# EAGLE design E-P-206-R1.0 Fuel Cell Control (EAGLE 6.6.0)

## Sheet 1 of 3: Connectors
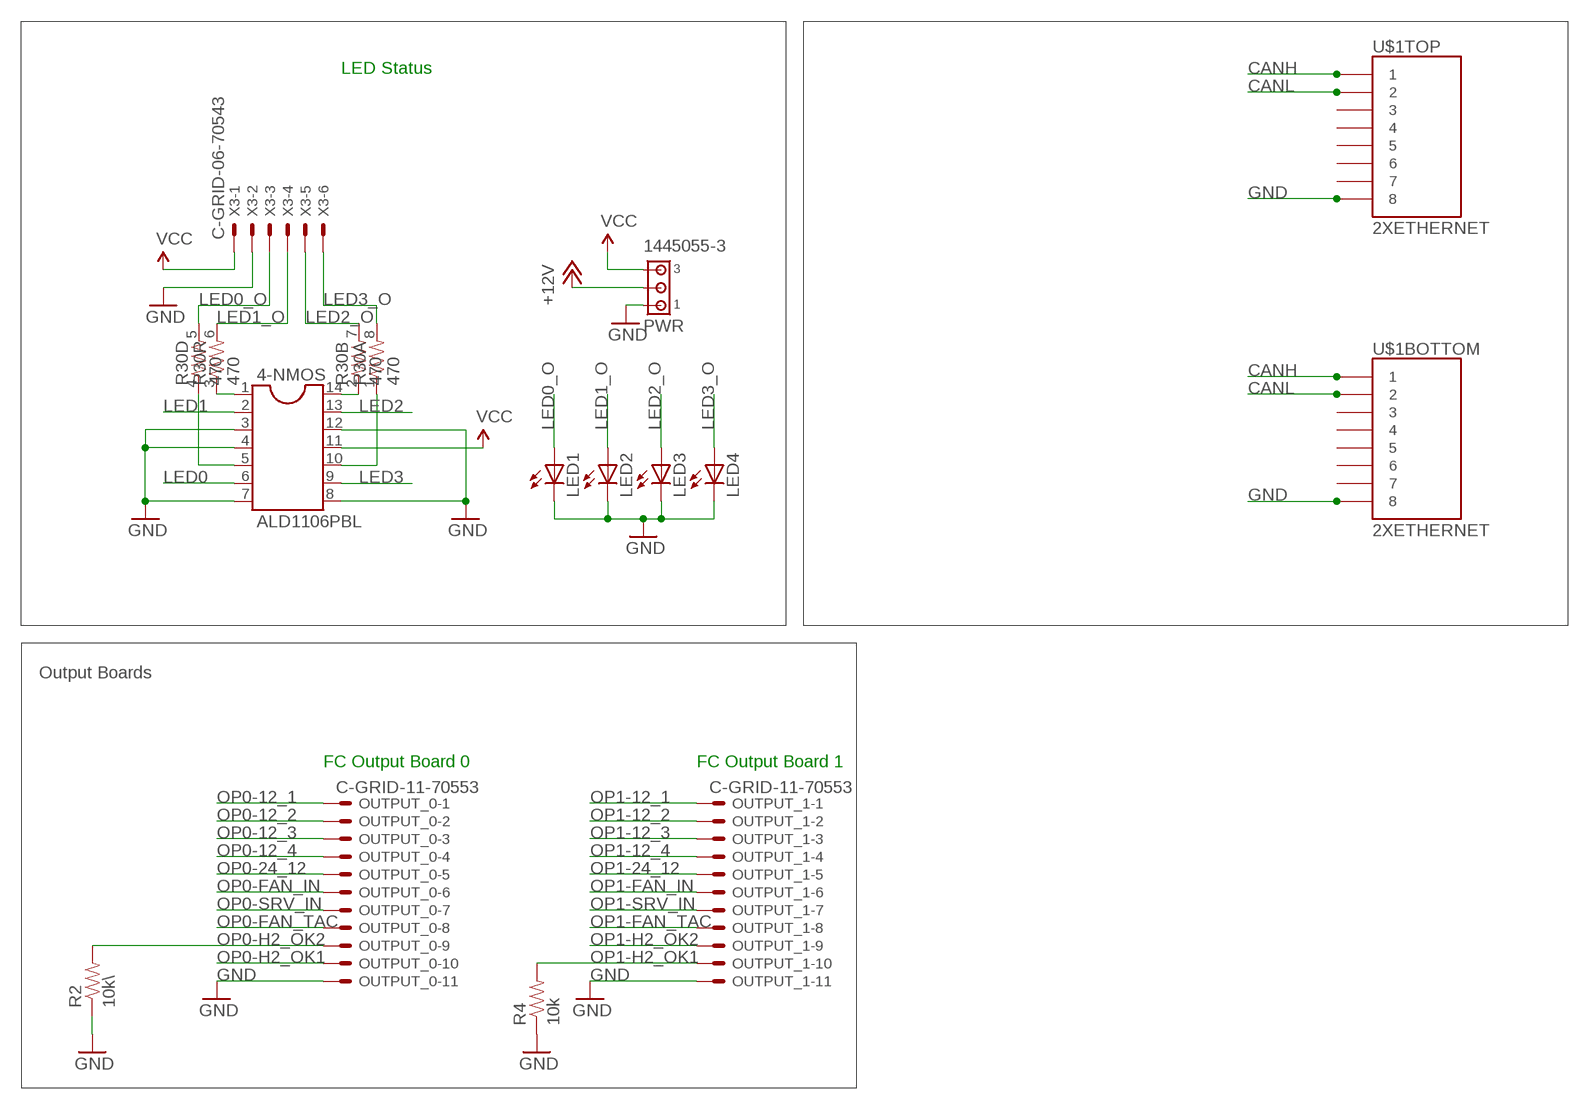
[diagram p0: schematic, sheet 1]

### Parts
4-NMOS  ALD1106PBL  DIL14SOIC  [SOIC-14]
LED1  LEDCHIPLED_1206  [CHIPLED_1206]
LED2  LEDCHIPLED_1206  [CHIPLED_1206]
LED3  LEDCHIPLED_1206  [CHIPLED_1206]
LED4  LEDCHIPLED_1206  [CHIPLED_1206]
OUTPUT_0  C-GRID-11-70553  [70553-11]
OUTPUT_1  C-GRID-11-70553  [70553-11]
PWR  1445055-3  [1445055-3]
R2  10k\  RESISTOR1206  [1206]
R4  10k  RESISTOR1206  [1206]
R30  470  RESISTOR-ARRAY0603-ARV  [0603-ARV]
U$1  2XETHERNET  [2XETHERNET]
X3  C-GRID-06-70543  [70543-06]

### Nets
+12V: PWR.2 ; also sheet 2
CANH: U$1.B_1 U$1.T_1 ; also sheet 3
CANL: U$1.B_2 U$1.T_2 ; also sheet 3
GND: 4-NMOS.3 4-NMOS.4 4-NMOS.7 4-NMOS.8 4-NMOS.12 LED1.C LED2.C LED3.C LED4.C OUTPUT_0.11 OUTPUT_1.11 PWR.1 R2.1 R4.1 U$1.B_8 U$1.T_8 X3.2 ; also sheet 2,3
LED0: 4-NMOS.6 ; also sheet 3
LED0_O: LED1.A R30.5 X3.3
LED1: 4-NMOS.2 ; also sheet 3
LED1_O: LED2.A R30.6 X3.4
LED2: 4-NMOS.13 ; also sheet 3
LED2_O: LED3.A R30.7 X3.5
LED3: 4-NMOS.9 ; also sheet 3
LED3_O: LED4.A R30.8 X3.6
N$2: 4-NMOS.5 R30.4
N$4: 4-NMOS.1 R30.3
N$7: 4-NMOS.14 R30.2
N$8: 4-NMOS.10 R30.1
OP0-12_1: OUTPUT_0.1 ; also sheet 3
OP0-12_2: OUTPUT_0.2 ; also sheet 3
OP0-12_3: OUTPUT_0.3 ; also sheet 3
OP0-12_4: OUTPUT_0.4 ; also sheet 3
OP0-24_12: OUTPUT_0.5 ; also sheet 3
OP0-FAN_IN: OUTPUT_0.6 ; also sheet 3
OP0-FAN_TAC: OUTPUT_0.8 ; also sheet 3
OP0-H2_OK1: OUTPUT_0.10 ; also sheet 3
OP0-H2_OK2: OUTPUT_0.9 R2.2 ; also sheet 3
OP0-SRV_IN: OUTPUT_0.7 ; also sheet 3
OP1-12_1: OUTPUT_1.1 ; also sheet 3
OP1-12_2: OUTPUT_1.2 ; also sheet 3
OP1-12_3: OUTPUT_1.3 ; also sheet 3
OP1-12_4: OUTPUT_1.4 ; also sheet 3
OP1-24_12: OUTPUT_1.5 ; also sheet 3
OP1-FAN_IN: OUTPUT_1.6 ; also sheet 3
OP1-FAN_TAC: OUTPUT_1.8 ; also sheet 3
OP1-H2_OK1: OUTPUT_1.10 R4.2 ; also sheet 3
OP1-H2_OK2: OUTPUT_1.9 ; also sheet 3
OP1-SRV_IN: OUTPUT_1.7 ; also sheet 3
VCC: 4-NMOS.11 PWR.3 X3.1 ; also sheet 2,3
Unconnected: U$1.B_3 U$1.B_4 U$1.B_5 U$1.B_6 U$1.B_7 U$1.B_9(BTM_LED_0:A) U$1.B_10(BTM_LED_0:C) U$1.B_11(BTM_LED_1:A) U$1.B_12(BTM_LED_1:C) U$1.T_3 U$1.T_4 U$1.T_5 U$1.T_6 U$1.T_7 U$1.T_9(TOP_LED_0:A) U$1.T_10(TOP_LED_0:C) U$1.T_11(TOP_LED_1:A) U$1.T_12(TOP_LED_1:C)

### Notes on the sheet
- LED Status
- Output Boards
- FC Output Board 0 | FC Output Board 1

## Sheet 2 of 3: Sensors
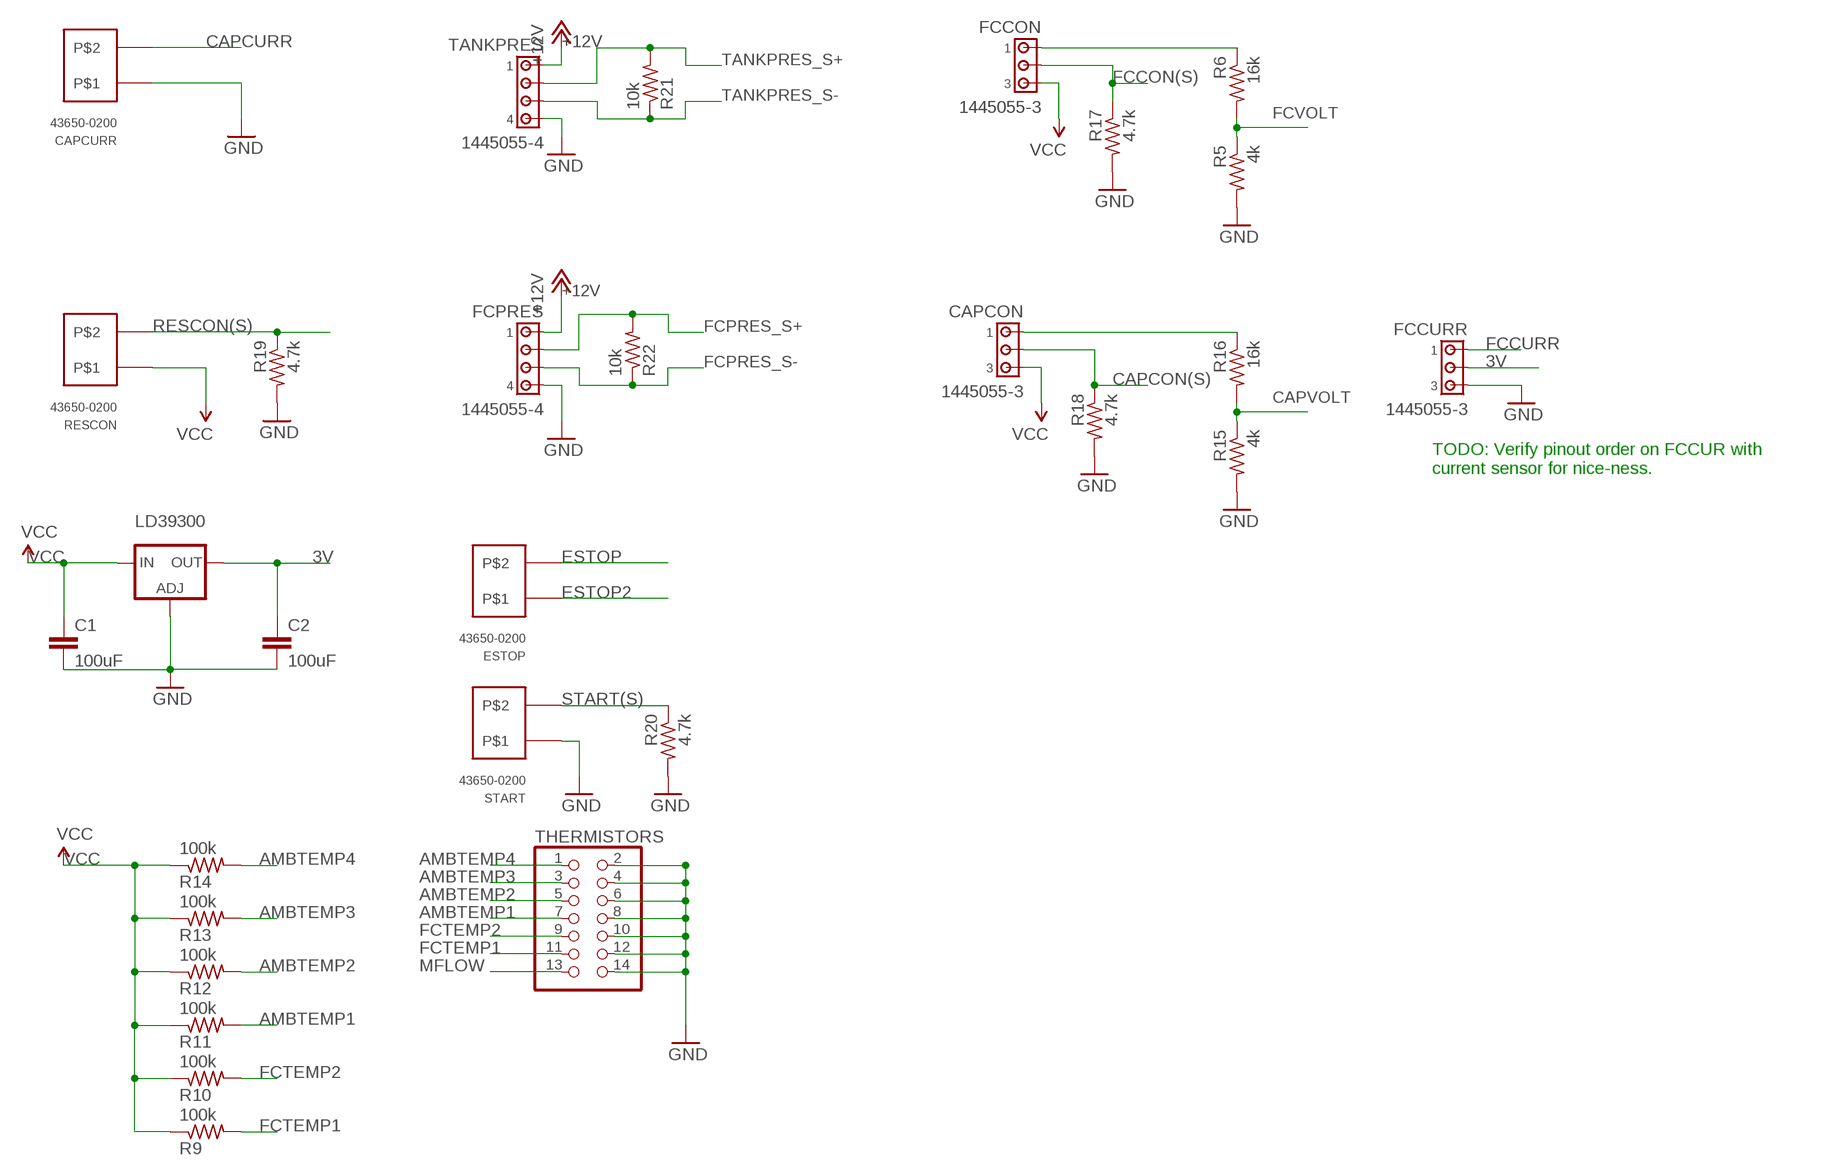
[diagram p1: schematic, sheet 2]

### Parts
C1  100uF  CAP1206  [1206]
C2  100uF  CAP1206  [1206]
CAPCON  1445055-3  [1445055-3]
CAPCURR  43650-0200  [43650-0200]
ESTOP  43650-0200  [43650-0200]
FCCON  1445055-3  [1445055-3]
FCCURR  1445055-3  [1445055-3]
FCPRES  1445055-4  [1445055-4]
LD39300  LD117ADT50TR  [DPACK]
R5  4k  R-US_M0805  [M0805]
R6  16k  R-US_M0805  [M0805]
R9  100k  R-US_M0805  [M0805]
R10  100k  R-US_M0805  [M0805]
R11  100k  R-US_M0805  [M0805]
R12  100k  R-US_M0805  [M0805]
R13  100k  R-US_M0805  [M0805]
R14  100k  R-US_M0805  [M0805]
R15  4k  R-US_M0805  [M0805]
R16  16k  R-US_M0805  [M0805]
R17  4.7k  R-US_M0805  [M0805]
R18  4.7k  R-US_M0805  [M0805]
R19  4.7k  R-US_M0805  [M0805]
R20  4.7k  R-US_M0805  [M0805]
R21  10k  R-US_M0805  [M0805]
R22  10k  R-US_M0805  [M0805]
RESCON  43650-0200  [43650-0200]
START  43650-0200  [43650-0200]
TANKPRES  1445055-4  [1445055-4]
THERMISTORS  PINHD-2X7  [2X07]

### Nets
3V: C2.1 FCCURR.2 LD39300.4(OUT)
+12V: FCPRES.1 TANKPRES.1 ; also sheet 1
AMBTEMP1: R11.2 THERMISTORS.7 ; also sheet 3
AMBTEMP2: R12.2 THERMISTORS.5 ; also sheet 3
AMBTEMP3: R13.2 THERMISTORS.3 ; also sheet 3
AMBTEMP4: R14.2 THERMISTORS.1 ; also sheet 3
CAPCON(S): CAPCON.2 R18.1
CAPCURR: CAPCURR.P$1 ; also sheet 3
CAPVOLT: R15.1 R16.2 ; also sheet 3
ESTOP: ESTOP.P$1 ; also sheet 3
ESTOP2: ESTOP.P$2 ; also sheet 3
FCCON(S): FCCON.2 R17.1
FCCURR: FCCURR.1 ; also sheet 3
FCPRES_S+: FCPRES.2 R22.2 ; also sheet 3
FCPRES_S-: FCPRES.3 R22.1 ; also sheet 3
FCTEMP1: R9.2 THERMISTORS.11 ; also sheet 3
FCTEMP2: R10.2 THERMISTORS.9 ; also sheet 3
FCVOLT: R5.1 R6.2 ; also sheet 3
FCVOLT+: FCCON.1 R6.1
FCVOLT+1: CAPCON.1 R16.1
GND: C1.2 C2.2 CAPCURR.P$2 FCCURR.3 FCPRES.4 LD39300.1(ADJ) R5.2 R15.2 R17.2 R18.2 R19.2 R20.2 START.P$2 TANKPRES.4 THERMISTORS.2 THERMISTORS.4 THERMISTORS.6 THERMISTORS.8 THERMISTORS.10 THERMISTORS.12 THERMISTORS.14 ; also sheet 1,3
MFLOW: THERMISTORS.13 ; also sheet 3
RESCON(S): R19.1 RESCON.P$1
START(S): R20.1 START.P$1
TANKPRES_S+: R21.2 TANKPRES.2 ; also sheet 3
TANKPRES_S-: R21.1 TANKPRES.3 ; also sheet 3
VCC: C1.1 CAPCON.3 FCCON.3 LD39300.3(IN) R9.1 R10.1 R11.1 R12.1 R13.1 R14.1 RESCON.P$2 ; also sheet 1,3

### Notes on the sheet
- TODO: Verify pinout order on FCCUR with 
  current sensor for nice-ness.

## Sheet 3 of 3: MCU
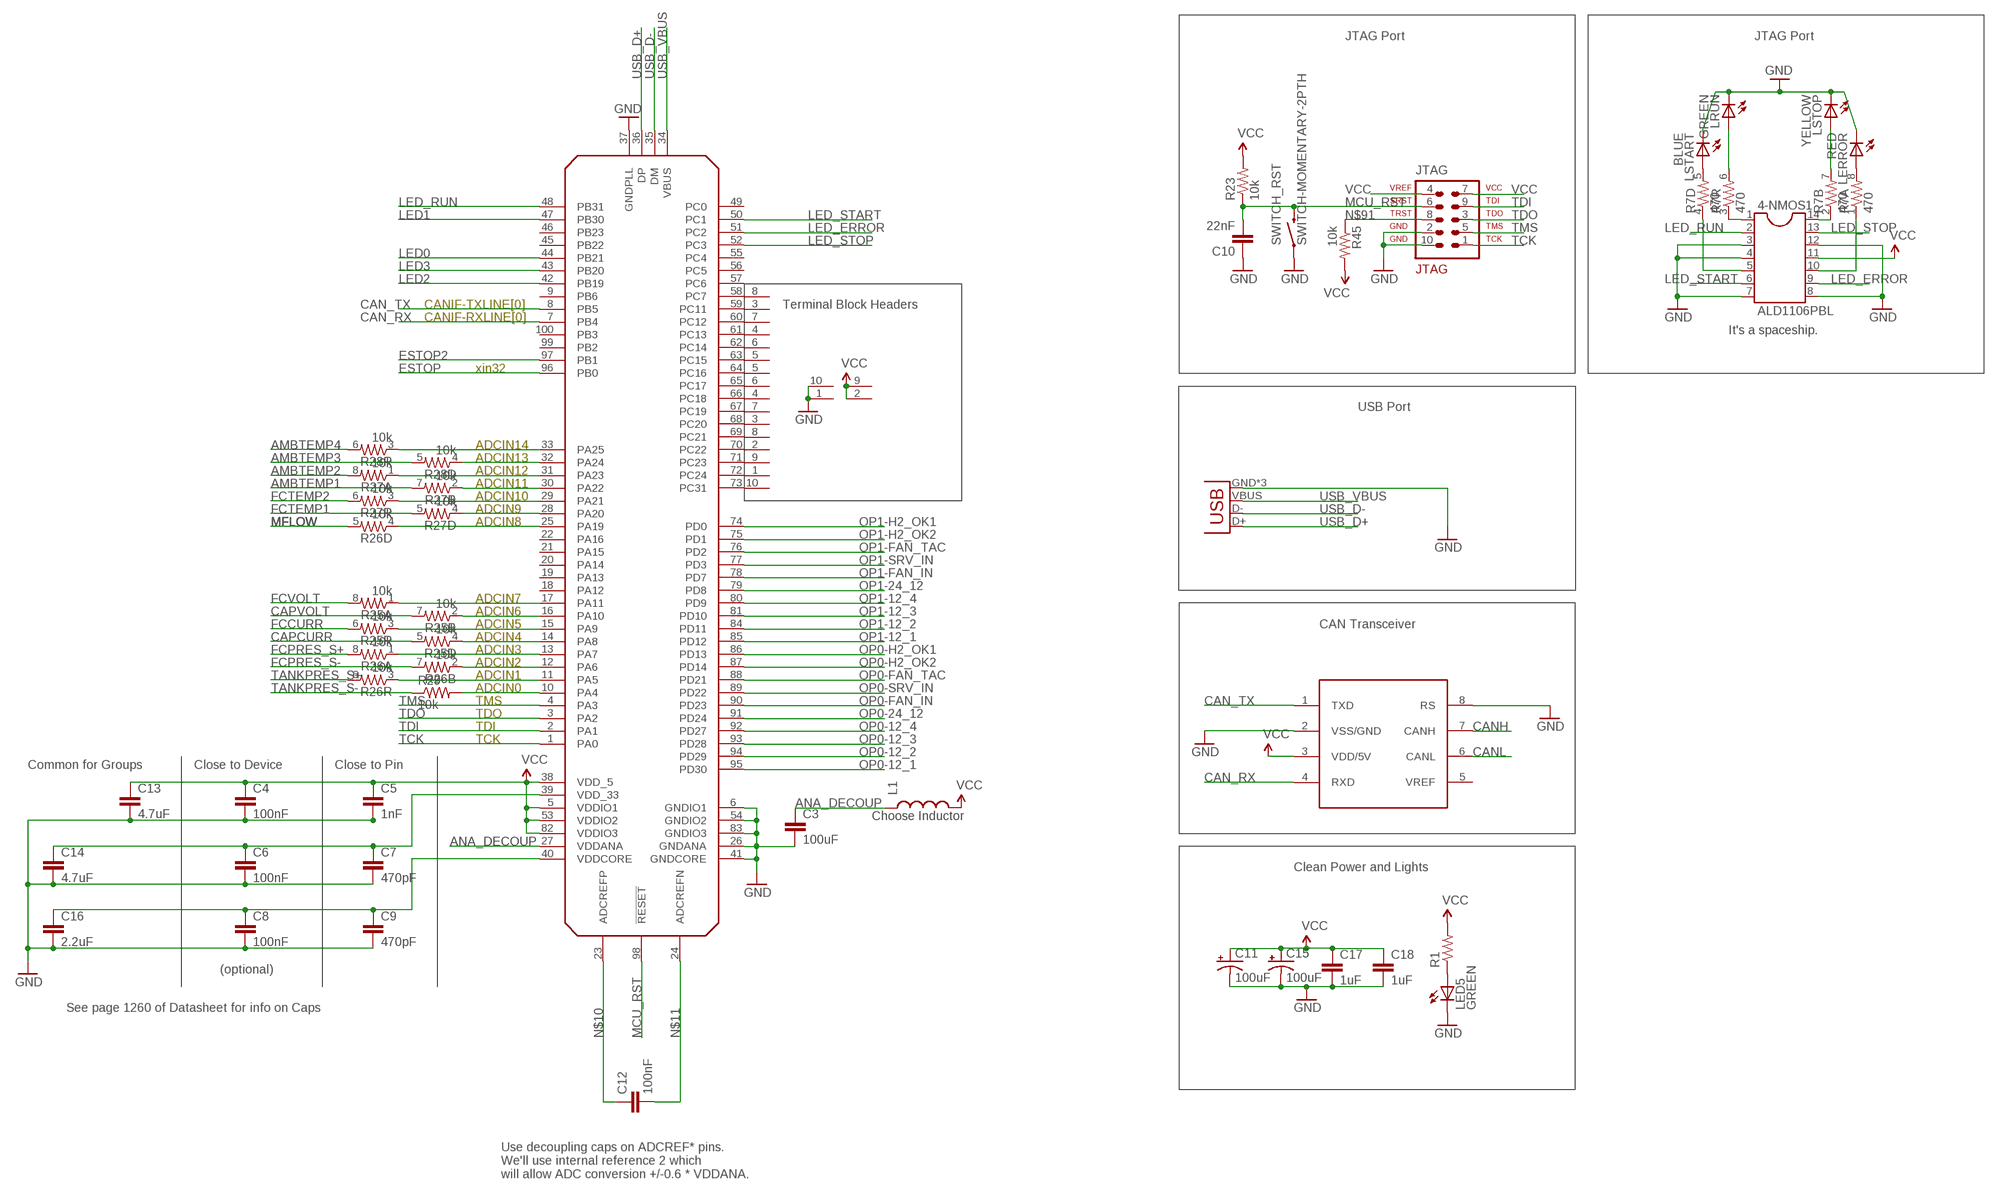
[diagram p2: schematic, sheet 3]

### Parts
4-NMOS1  ALD1106PBL  DIL14SOIC  [SOIC-14]
C3  100uF  CAP0805  [0805]
C4  100nF  CAP0805  [0805]
C5  1nF  CAP0805  [0805]
C6  100nF  CAP0805  [0805]
C7  470pF  CAP0805  [0805]
C8  100nF  CAP0805  [0805]
C9  470pF  CAP0805  [0805]
C10  22nF  CAP0805  [0805]
C11  100uF  CAP_POLC  [PANASONIC_C]
C12  100nF  CAP0805  [0805]
C13  4.7uF  CAP0805  [0805]
C14  4.7uF  CAP0805  [0805]
C15  100uF  CAP_POLC  [PANASONIC_C]
C16  2.2uF  CAP0805  [0805]
C17  1uF  CAP0805  [0805]
C18  1uF  CAP0805  [0805]
JP2  USB-MICROB  [USB-MICROB]
JTAG  AVR-JTAG-10  [AVR-JTAG-10]
L1  INDUCTOR0805  [0805]
LED5  GREEN  LED1206  [LED-1206]
LERROR  RED  LEDCHIPLED_1206  [CHIPLED_1206]
LRUN  GREEN  LEDCHIPLED_1206  [CHIPLED_1206]
LSTART  BLUE  LEDCHIPLED_1206  [CHIPLED_1206]
LSTOP  YELLOW  LEDCHIPLED_1206  [CHIPLED_1206]
MCU  AT32UC3C1512  [TQFP100]
R1  RESISTOR0805-RES  [0805]
R7  470  RESISTOR-ARRAY0603-ARV  [0603-ARV]
R23  10k  RESISTOR0805-RES  [0805]
R25  10k  RESISTOR-ARRAY0603-ARV  [0603-ARV]
R26  10k  RESISTOR-ARRAY0603-ARV  [0603-ARV]
R27  10k  RESISTOR-ARRAY0603-ARV  [0603-ARV]
R28  10k  RESISTOR-ARRAY0603-ARV  [0603-ARV]
R29  10k  RESISTOR0805-RES  [0805]
R45  10k  RESISTOR0805-RES  [0805]
SWITCH_RST  SWITCH-MOMENTARY-2PTH  [TACTILE-PTH]
U$2  10X1PCBBLOCK  [10X1PCBBLOCK]
U$3  10X1PCBBLOCK  [10X1PCBBLOCK]
U$4  MCP2551  [DIP8]

### Nets
AMBTEMP1: R27.7 ; also sheet 2
AMBTEMP2: R27.8 ; also sheet 2
AMBTEMP3: R28.5 ; also sheet 2
AMBTEMP4: R28.6 ; also sheet 2
ANA_DECOUP: C3.1 L1.1 MCU.27(VDDANA)
CAN_RX: MCU.7(PB4) U$4.4(RXD)
CAN_TX: MCU.8(PB5) U$4.1(TXD)
CANH: U$4.7(CANH) ; also sheet 1
CANL: U$4.6(CANL) ; also sheet 1
CAPCURR: R25.5 ; also sheet 2
CAPVOLT: R25.7 ; also sheet 2
ESTOP: MCU.96(PB0) ; also sheet 2
ESTOP2: MCU.97(PB1) ; also sheet 2
FCCURR: R25.6 ; also sheet 2
FCPRES_S+: R26.8 ; also sheet 2
FCPRES_S-: R26.7 ; also sheet 2
FCTEMP1: R27.5 ; also sheet 2
FCTEMP2: R27.6 ; also sheet 2
FCVOLT: R25.8 ; also sheet 2
GND: 4-NMOS1.3 4-NMOS1.4 4-NMOS1.7 4-NMOS1.8 4-NMOS1.12 C3.2 C4.2 C5.2 C6.2 C7.2 C8.2 C9.2 C10.1 C11.- C13.2 C14.2 C15.- C16.2 C17.2 C18.2 JP2.GND JP2.MT1(GND) JP2.MT2(GND) JTAG.2 JTAG.10 LED5.C LERROR.C LRUN.C LSTART.C LSTOP.C MCU.6(GNDIO1) MCU.26(GNDANA) MCU.37(GNDPLL) MCU.41(GNDCORE) MCU.54(GNDIO2) MCU.83(GNDIO3) SWITCH_RST.1 U$2.10 U$3.1 U$4.2(VSS/GND) U$4.8(RS) ; also sheet 1,2
LED0: MCU.44(PB21) ; also sheet 1
LED1: MCU.47(PB30) ; also sheet 1
LED2: MCU.42(PB19) ; also sheet 1
LED3: MCU.43(PB20) ; also sheet 1
LED_ERROR: 4-NMOS1.9 MCU.51(PC2)
LED_RUN: 4-NMOS1.2 MCU.48(PB31)
LED_START: 4-NMOS1.6 MCU.50(PC1)
LED_STOP: 4-NMOS1.13 MCU.52(PC3)
MCU_RST: C10.2 JTAG.6 MCU.98(!RESET) R23.1 SWITCH_RST.3
MFLOW: R26.5 ; also sheet 2
N$1: MCU.10(PA4) R29.2
N$3: MCU.12(PA6) R26.2
N$5: MCU.13(PA7) R26.1
N$6: C6.1 C7.1 C14.1 MCU.39(VDD_33)
N$9: C8.1 C9.1 C16.1 MCU.40(VDDCORE)
N$10: C12.1 MCU.23(ADCREFP)
N$11: C12.2 MCU.24(ADCREFN)
N$12: MCU.72(PC24) U$2.1
N$13: MCU.11(PA5) R26.3
N$14: MCU.70(PC22) U$2.2
N$15: MCU.25(PA19) R26.4
N$16: MCU.68(PC20) U$2.3
N$17: MCU.28(PA20) R27.4
N$18: MCU.30(PA22) R27.2
N$19: MCU.32(PA24) R28.4
N$20: MCU.33(PA25) R28.3
N$21: MCU.14(PA8) R25.4
N$22: MCU.66(PC18) U$2.4
N$23: MCU.64(PC16) U$2.5
N$24: MCU.62(PC14) U$2.6
N$25: MCU.31(PA23) R27.1
N$26: MCU.29(PA21) R27.3
N$27: MCU.15(PA9) R25.3
N$28: MCU.16(PA10) R25.2
N$29: MCU.17(PA11) R25.1
N$30: MCU.60(PC12) U$2.7
N$31: MCU.58(PC7) U$2.8
N$32: 4-NMOS1.5 R7.4
N$33: 4-NMOS1.1 R7.3
N$34: LED5.A R1.1
N$36: MCU.59(PC11) U$3.3
N$37: MCU.61(PC13) U$3.4
N$38: MCU.63(PC15) U$3.5
N$39: MCU.65(PC17) U$3.6
N$40: MCU.67(PC19) U$3.7
N$41: MCU.69(PC21) U$3.8
N$42: MCU.71(PC23) U$3.9
N$43: MCU.73(PC31) U$3.10
N$44: 4-NMOS1.14 R7.2
N$45: 4-NMOS1.10 R7.1
N$46: LSTART.A R7.5
N$47: LERROR.A R7.8
N$48: LSTOP.A R7.7
N$49: LRUN.A R7.6
N$91: JTAG.8 R45.1
OP0-12_1: MCU.95(PD30) ; also sheet 1
OP0-12_2: MCU.94(PD29) ; also sheet 1
OP0-12_3: MCU.93(PD28) ; also sheet 1
OP0-12_4: MCU.92(PD27) ; also sheet 1
OP0-24_12: MCU.91(PD24) ; also sheet 1
OP0-FAN_IN: MCU.90(PD23) ; also sheet 1
OP0-FAN_TAC: MCU.88(PD21) ; also sheet 1
OP0-H2_OK1: MCU.86(PD13) ; also sheet 1
OP0-H2_OK2: MCU.87(PD14) ; also sheet 1
OP0-SRV_IN: MCU.89(PD22) ; also sheet 1
OP1-12_1: MCU.85(PD12) ; also sheet 1
OP1-12_2: MCU.84(PD11) ; also sheet 1
OP1-12_3: MCU.81(PD10) ; also sheet 1
OP1-12_4: MCU.80(PD9) ; also sheet 1
OP1-24_12: MCU.79(PD8) ; also sheet 1
OP1-FAN_IN: MCU.78(PD7) ; also sheet 1
OP1-FAN_TAC: MCU.76(PD2) ; also sheet 1
OP1-H2_OK1: MCU.74(PD0) ; also sheet 1
OP1-H2_OK2: MCU.75(PD1) ; also sheet 1
OP1-SRV_IN: MCU.77(PD3) ; also sheet 1
TANKPRES_S+: R26.6 ; also sheet 2
TANKPRES_S-: R29.1 ; also sheet 2
TCK: JTAG.1 MCU.1(PA0)
TDI: JTAG.9 MCU.2(PA1)
TDO: JTAG.3 MCU.3(PA2)
TMS: JTAG.5 MCU.4(PA3)
USB_D+: JP2.D+ MCU.36(DP)
USB_D-: JP2.D- MCU.35(DM)
USB_VBUS: JP2.VBUS MCU.34(VBUS)
VCC: 4-NMOS1.11 C4.1 C5.1 C11.+ C13.1 C15.+ C17.1 C18.1 JTAG.4 JTAG.7 L1.2 MCU.5(VDDIO1) MCU.38(VDD_5) MCU.53(VDDIO2) MCU.82(VDDIO3) R1.2 R23.2 R45.2 U$2.9 U$3.2 U$4.3(VDD/5V) ; also sheet 1,2
Unconnected: MCU.9(PB6) MCU.18(PA12) MCU.19(PA13) MCU.20(PA14) MCU.21(PA15) MCU.22(PA16) MCU.45(PB22) MCU.46(PB23) MCU.49(PC0) MCU.55(PC4) MCU.56(PC5) MCU.57(PC6) MCU.99(PB2) MCU.100(PB3) R28.1 R28.2 R28.7 R28.8 U$4.5(VREF)

### Notes on the sheet
- JTAG Port | JTAG Port
- CANIF-TXLINE[0] | Terminal Block Headers
- CANIF-RXLINE[0]
- It's a spaceship.
- xin32
- USB Port
- ADCIN14
- ADCIN13
- ADCIN12
- ADCIN11
- ADCIN10
- ADCIN9
- ADCIN8
- ADCIN7
- ADCIN6
- ADCIN5 | CAN Transceiver
- ADCIN4
- ADCIN3
- ADCIN2
- ADCIN1
- ADCIN0
- TMS
- TDO
- TDI
- TCK
- Common for Groups | Close to Device | Close to Pin
- Choose Inductor
- Clean Power and Lights
- (optional)
- See page 1260 of Datasheet for info on Caps
- Use decoupling caps on ADCREF* pins.
  We'll use internal reference 2 which 
  will allow ADC conversion +/-0.6 * VDDANA.

## Library data of the parts
4-NMOS 4-NMOS1 = Shell2013:DIL14: Dual In Line / Socket
C1 C2 = SparkFun:CAP: Capacitor Standard 0603 ceramic capacitor, and 0.1" leaded capacitor.
C3-C10 C12-C14 C16-C18 = SparkFun-Capacitors:CAP: Capacitor Standard 0603 ceramic capacitor, and 0.1" leaded capacitor.
C11 C15 = SparkFun-Capacitors:CAP_POL: Capacitor Polarized These are standard SMD and PTH capacitors. Normally 10uF, 47uF, and 100uF in electrolytic and tantalum varieties. Always verify the external diameter of the through hole cap, it varies with capacity, voltage, and manufacturer. The EIA devices should be standard.
CAPCON FCCON FCCURR PWR = con-amp:1445055-3: Micro MATE-N-LOK Connectors grid 1.5 mm Source: ENG_CD_1445055_A.pdf
CAPCURR ESTOP RESCON START = Shell2013:43650-0200
FCPRES TANKPRES = con-amp:1445055-4: Micro MATE-N-LOK Connectors grid 1.5 mm Source: ENG_CD_1445055_A.pdf
JP2 = SparkFun-Connectors:USB: USB Connectors USB-B-PTH is fully proven SKU : PRT-00139/CONN-08278 USB-miniB is fully proven SKU : PRT-00587 USB-A-PCB is untested. USB-A-H is throughly reviewed, but untested. Spark Fun Electronics SKU : PRT-00437 USB-B-SMT is throughly reviewed, but untested. Needs silkscreen touching up. USB-A-S has not been used/tested USB-MB-H has not been used/tested USB-MICROB has been used. CONN-09505; PROD_ID: CONN-09505
JTAG = avr-7:AVR-JTAG-10: AVR JTAG Debug/Programming Header
L1 = SparkFun-Passives:INDUCTOR: Inductors Basic Inductor/Choke - 0603 and 1206. Footprints are not proven and vary greatly between part numbers. SRN6045- 33uH, 20% 1.4A SDR0403-560KL - 56uH, 10%, 500mA RMS/740mA peak
LD39300 = v-reg:LD117A?*: Low drop fixed and adjustable positive voltage regulators 1 A Source: http://www.st.com/stonline/products/literature/ds/7194/ld1117axx.pdf
LED1-LED4 LERROR LRUN LSTART LSTOP = led:LED: LED OSRAM: - CHIPLED LG R971, LG N971, LY N971, LG Q971, LY Q971, LO R971, LY R971 LH N974, LH R974 LS Q976, LO Q976, LY Q976 LO Q996 - Hyper CHIPLED LW Q18S LB Q993, LB Q99A, LB R99A - SideLED LS A670, LO A670, LY A670, LG A670, LP A670 LB A673, LV A673, LT A673, LW A673 LH A674 LY A675 LS A676, LA A676, LO A676, LY A676, LW A676 LS A679, LY A679, LG A679 - Hyper Micro SIDELED® LS Y876, LA Y876, LO Y876, LY Y876 LT Y87S - SmartLED LW L88C, LW L88S LB L89C, LB L89S, LG L890 LS L89K, LO L89K, LY L89K LS L896, LA L896, LO L896, LY L896 - TOPLED LS T670, LO T670, LY T670, LG T670, LP T670 LSG T670, LSP T670, LSY T670, LOP T670, LYG T670 LG T671, LOG T671, LSG T671 LB T673, LV T673, LT T673, LW T673 LH T674 LS T676, LA T676, LO T676, LY T676, LB T676, LH T676, LSB T676, LW T676 LB T67C, LV T67C, LT T67C, LS T67K, LO T67K, LY T67K, LW E67C LS E67B, LA E67B, LO E67B, LY E67B, LB E67C, LV E67C, LT E67C LW T67C LS T679, LY T679, LG T679 LS T770, LO T770, LY T770, LG T770, LP T770 LB T773, LV T773, LT T773, LW T773 LH T774 LS E675, LA E675, LY E675, LS T675 LS T776, LA T776, LO T776, LY T776, LB T776 LHGB T686 LT T68C, LB T68C - Hyper Mini TOPLED® LB M676 - Mini TOPLED Santana® LG M470 LS M47K, LO M47K, LY M47K Source: http://www.osram.convergy.de LUXEON: - LUMILED® LXK2-PW12-R00, LXK2-PW12-S00, LXK2-PW14-U00, LXK2-PW14-V00 LXK2-PM12-R00, LXK2-PM12-S00, LXK2-PM14-U00 LXK2-PE12-Q00, LXK2-PE12-R00, LXK2-PE12-S00, LXK2-PE14-T00, LXK2-PE14-U00 LXK2-PB12-K00, LXK2-PB12-L00, LXK2-PB12-M00, LXK2-PB14-N00, LXK2-PB14-P00, LXK2-PB14-Q00 LXK2-PR12-L00, LXK2-PR12-M00, LXK2-PR14-Q00, LXK2-PR14-R00 LXK2-PD12-Q00, LXK2-PD12-R00, LXK2-PD12-S00 LXK2-PH12-R00, LXK2-PH12-S00 LXK2-PL12-P00, LXK2-PL12-Q00, LXK2-PL12-R00 Source: www.luxeon.com KINGBRIGHT: KA-3528ASYC Source: www.kingbright.com
LED5 = SparkFun-LED:LED: LEDs Standard schematic elements and footprints for 5mm, 3mm, 1206, and 0603 sized LEDs. 5mm - Spark Fun Electronics SKU : COM-00529 (and others)
MCU = uniq-at32uc3c:AT32UC3C1: ATMEL 32-bit Microcontroller 64KB, 128KB, 256KB, 512KB 100-pin TQFP (81 GPIO pins) http://www.atmel.com/Images/32117s.pdf; FLASH: 512KB
OUTPUT_0 OUTPUT_1 = con-molex:C-GRID-11: CONNECTOR wire to board 2.54 mm (0.100") pitch header; OC_FARNELL: unknown; OC_NEWARK: unknown
R1 = SparkFun-Passives:RESISTOR: Resistor Basic schematic elements and footprints for 0603, 1206, and PTH resistors.
R2 R4 = SparkFun:RESISTOR: Resistor Basic schematic elements and footprints for 0603, 1206, and PTH resistors.
R5 R6 R9-R22 = resistor:R-US_: RESISTOR, American symbol
R7 R25-R28 R30 = SparkFun-Resistors:RESISTOR-ARRAY: Array Chip Resistor Source: RS Component / Phycomp
R23 R29 R45 = SparkFun-Resistors:RESISTOR: Resistor Basic schematic elements and footprints for 0603, 1206, and PTH resistors.
SWITCH_RST = SparkFun-Electromechanical:SWITCH-MOMENTARY-2: Various NO switches- pushbuttons, reed, etc
THERMISTORS = Shell2013:PINHD-2X7: PIN HEADER
U$1 = Shell2013:2XETHERNET
U$2 U$3 = Shell2013:10X1PCBBLOCK
U$4 = Shell2013:MCP2551
X3 = con-molex:C-GRID-06: CONNECTOR wire to board 2.54 mm (0.100") pitch header; OC_FARNELL: unknown; OC_NEWARK: unknown

## Board
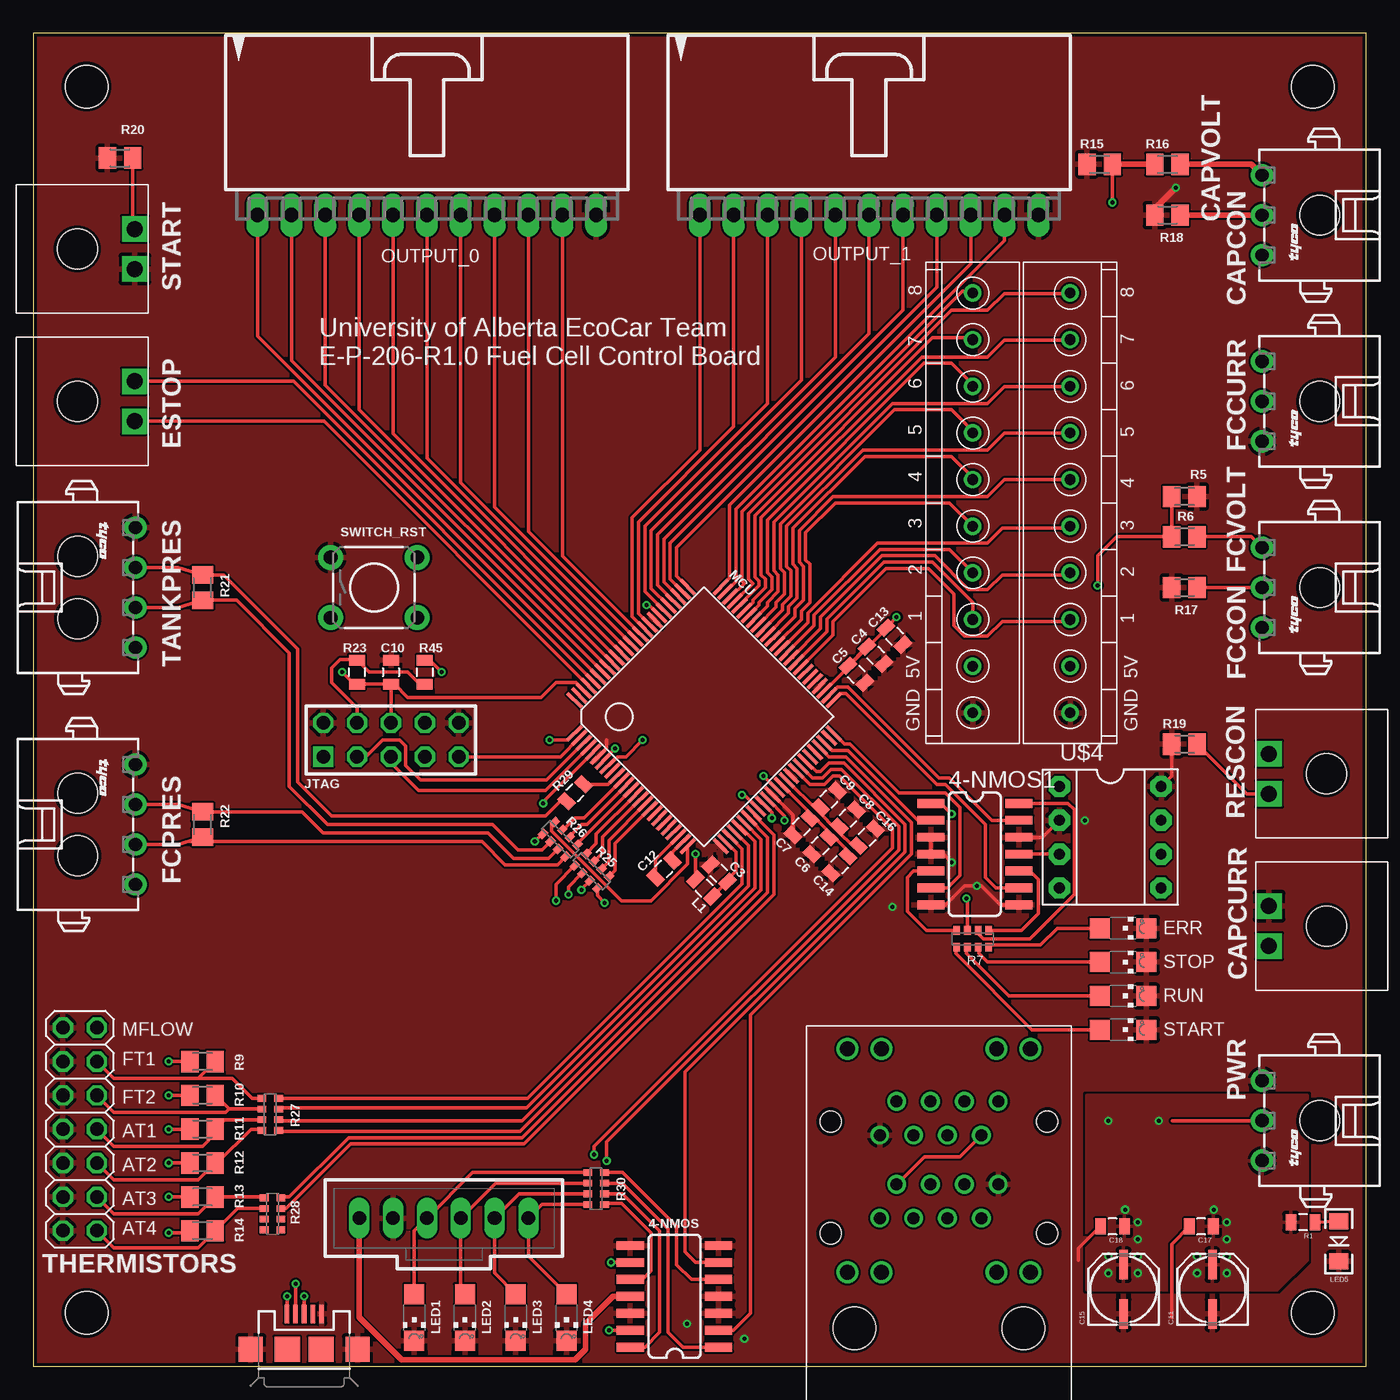
[diagram p3: board, top side]
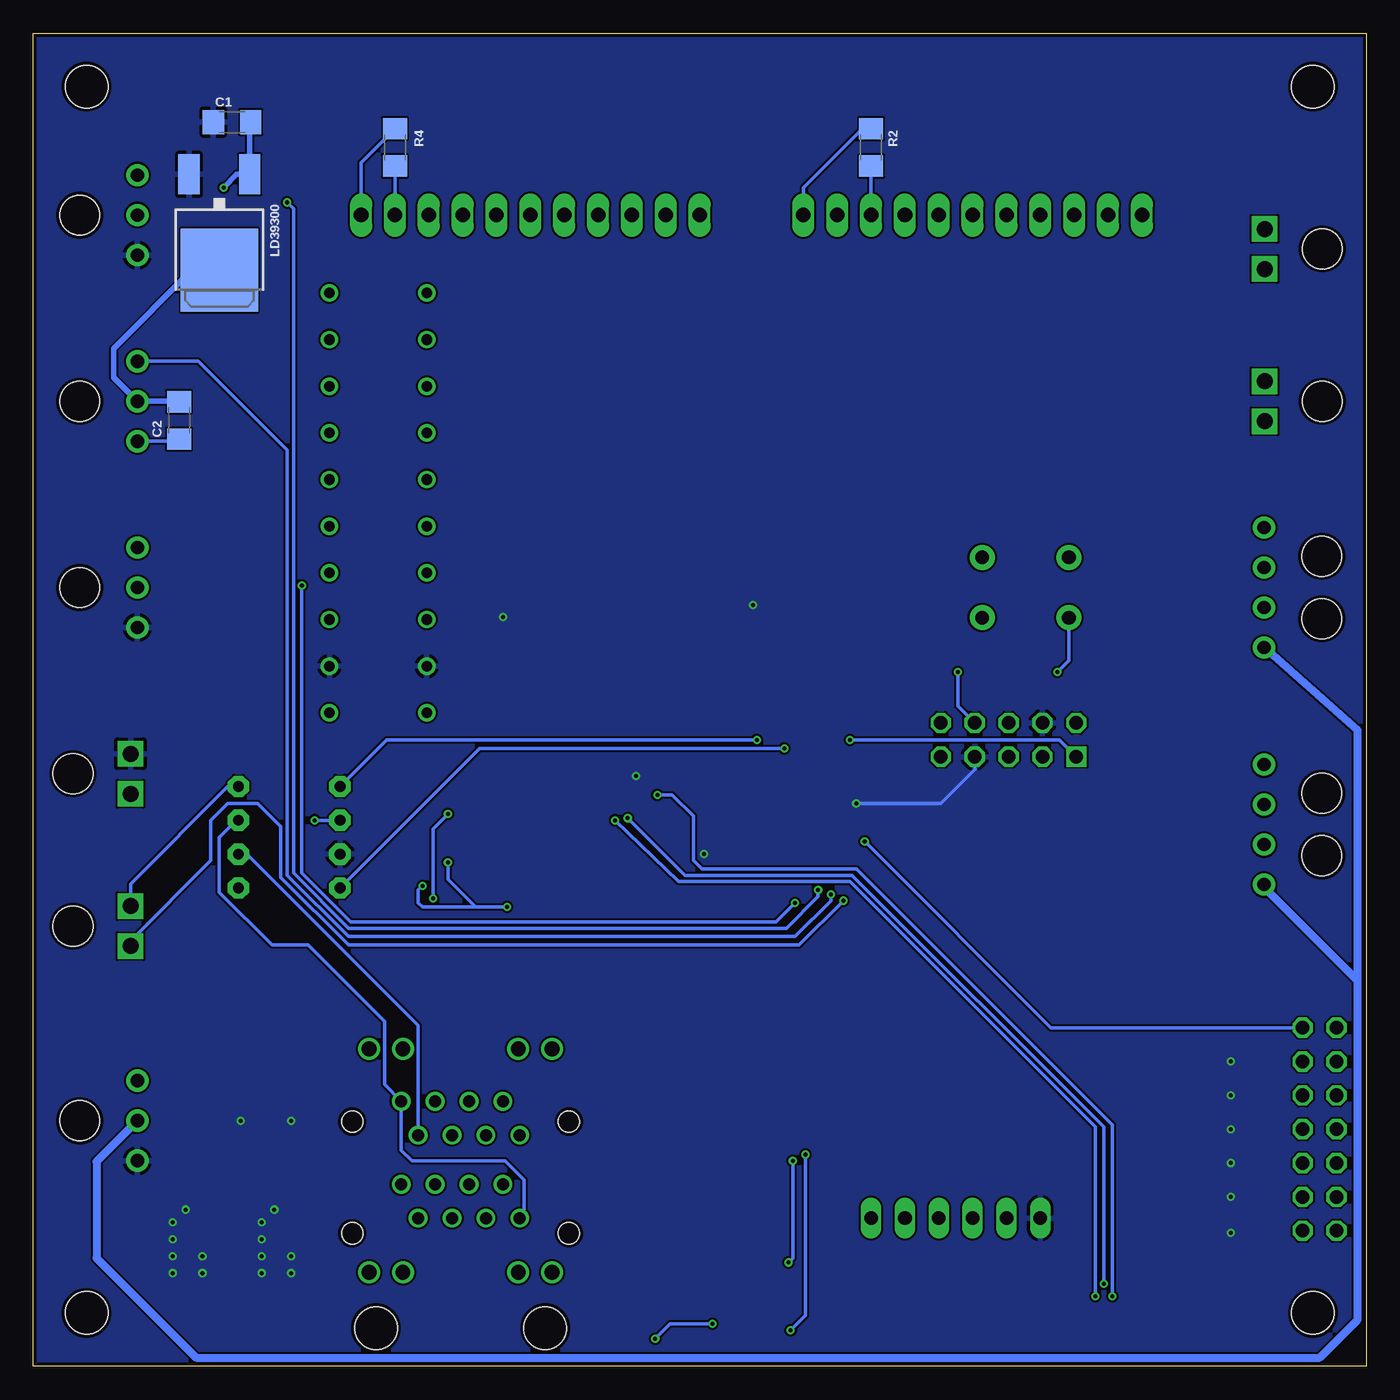
[diagram p4: board, bottom side, seen from below]

Size 100 x 100 mm. Coordinates in mm from the lower left corner, seen from the top.
Outline: 0,0 100,0 100,100 0,100 0,0
Copper layers (1*16): Top 0.035mm / dielectric 1.5mm / Bottom 0.035mm
Design rules "ITEADstudio_DRC": minimum track width 6mil, minimum drill 12mil, track to track 6mil, track to pad 6mil, pad to pad 6mil, via to via 6mil, smd to smd 0mil, copper to edge 10mil, drill to drill 10mil, minimum pad ring 10mil, minimum via ring 6mil, stop-mask expansion 2mil, vias tented up to drill 100mil, thermal gap 10mil
Holes 3.2 mm at 4,4 96,4 4,96 96,96

### Footprints (pad centres in the part's own frame; a part is rotated, then mirrored left to right if it is on the bottom)
SOIC-14 = smd 0.66 x 2.032: 1 -4.445,-3.315; 2 -3.175,-3.315; 3 -1.905,-3.315; 4 -0.635,-3.315; 5 0.635,-3.315; 6 1.905,-3.315; 7 3.175,-3.315; 8 3.175,3.315; 9 1.905,3.315; 10 0.635,3.315; 11 -0.635,3.315; 12 -1.905,3.315; 13 -3.175,3.315; 14 -4.445,3.315
1206 = smd 1.6 x 1.8: 1 -1.4,0; 2 1.4,0
0805 = smd 0.8 x 1.2: 1 -0.9,0; 2 0.9,0
PANASONIC_C = smd 2.2 x 0.65: + 1.9,-0.2; - -1.8,-0.2
1445055-3 = drill 1 pad 1.676: 1 3,4.32; 2 0,4.32; 3 -3,4.32 | hole 3: 0,0
43650-0200 = drill 1.2 pad 1.93 square: P$1 -1.5,0; P$2 1.5,0 | hole 3: 0,-4.32
1445055-4 = drill 1 pad 1.676: 1 4.5,4.32; 2 1.5,4.32; 3 -1.5,4.32; 4 -4.5,4.32 | hole 3: -2.35,0; 2.35,0
USB-MICROB = smd 0.35 x 1.4: D+ 0,2.65; D- -0.65,2.65; GND 1.3,2.65; ID 0.65,2.65; VBUS -1.3,2.65 | smd 1.8 x 1.9: MT1 -4,0; MT2 4,0 | smd 1.9 x 1.9: P$1 -1.27,0; P$2 1.27,0
AVR-JTAG-10 = drill 1.016 square: 1 -5.08,-1.27 | drill 1.016 octagon: 2 -5.08,1.27; 3 -2.54,-1.27; 4 -2.54,1.27; 5 0,-1.27; 6 0,1.27; 7 2.54,-1.27; 8 2.54,1.27; 9 5.08,-1.27; 10 5.08,1.27
DPACK = smd 1.6 x 3: 1 -2.28,-4.8; 3 2.28,-4.8 | smd 5.8 x 6.2: 4 0,2.38
CHIPLED_1206 = smd 1.5 x 1.5: A 0,-1.75; C 0,1.75
LED-1206 = smd 1.2 x 1.4: A -1.5,0; C 1.5,0
TQFP100 = smd 0.27 x 1.5: 1 -6,-7.75; 2 -5.5,-7.75; 3 -5,-7.75; 4 -4.5,-7.75; 5 -4,-7.75; 6 -3.5,-7.75; 7 -3,-7.75; 8 -2.5,-7.75; 9 -2,-7.75; 10 -1.5,-7.75; 11 -1,-7.75; 12 -0.5,-7.75; 13 0,-7.75; 14 0.5,-7.75; 15 1,-7.75; 16 1.5,-7.75; 17 2,-7.75; 18 2.5,-7.75; 19 3,-7.75; 20 3.5,-7.75; 21 4,-7.75; 22 4.5,-7.75; 23 5,-7.75; 24 5.5,-7.75; 25 6,-7.75; 51 6,7.75; 52 5.5,7.75; 53 5,7.75; 54 4.5,7.75; 55 4,7.75; 56 3.5,7.75; 57 3,7.75; 58 2.5,7.75; 59 2,7.75; 60 1.5,7.75; 61 1,7.75; 62 0.5,7.75; 63 0,7.75; 64 -0.5,7.75; 65 -1,7.75; 66 -1.5,7.75; 67 -2,7.75; 68 -2.5,7.75; 69 -3,7.75; 70 -3.5,7.75; 71 -4,7.75; 72 -4.5,7.75; 73 -5,7.75; 74 -5.5,7.75; 75 -6,7.75 | smd 1.5 x 0.27: 26 7.75,-6; 27 7.75,-5.5; 28 7.75,-5; 29 7.75,-4.5; 30 7.75,-4; 31 7.75,-3.5; 32 7.75,-3; 33 7.75,-2.5; 34 7.75,-2; 35 7.75,-1.5; 36 7.75,-1; 37 7.75,-0.5; 38 7.75,0; 39 7.75,0.5; 40 7.75,1; 41 7.75,1.5; 42 7.75,2; 43 7.75,2.5; 44 7.75,3; 45 7.75,3.5; 46 7.75,4; 47 7.75,4.5; 48 7.75,5; 49 7.75,5.5; 50 7.75,6; 76 -7.75,6; 77 -7.75,5.5; 78 -7.75,5; 79 -7.75,4.5; 80 -7.75,4; 81 -7.75,3.5; 82 -7.75,3; 83 -7.75,2.5; 84 -7.75,2; 85 -7.75,1.5; 86 -7.75,1; 87 -7.75,0.5; 88 -7.75,0; 89 -7.75,-0.5; 90 -7.75,-1; 91 -7.75,-1.5; 92 -7.75,-2; 93 -7.75,-2.5; 94 -7.75,-3; 95 -7.75,-3.5; 96 -7.75,-4; 97 -7.75,-4.5; 98 -7.75,-5; 99 -7.75,-5.5; 100 -7.75,-6
70553-11 = drill 1.092 long: 1 -12.7,-7.62; 2 -10.16,-7.62; 3 -7.62,-7.62; 4 -5.08,-7.62; 5 -2.54,-7.62; 6 0,-7.62; 7 2.54,-7.62; 8 5.08,-7.62; 9 7.62,-7.62; 10 10.16,-7.62; 11 12.7,-7.62
M0805 = smd 1.3 x 1.6: 1 -0.95,0; 2 0.95,0
0603-ARV = smd 0.5 x 0.65: 1 -1.2,-0.625; 2 -0.4,-0.625; 3 0.4,-0.625; 4 1.2,-0.625; 5 1.2,0.625; 6 0.4,0.625; 7 -0.4,0.625; 8 -1.2,0.625
TACTILE-PTH = drill 1.016 pad 1.88: 1 -3.251,2.261; 2 3.251,2.261; 3 -3.251,-2.261; 4 3.251,-2.261
2X07 = drill 1.016 octagon: 1 -7.62,-1.27; 2 -7.62,1.27; 3 -5.08,-1.27; 4 -5.08,1.27; 5 -2.54,-1.27; 6 -2.54,1.27; 7 0,-1.27; 8 0,1.27; 9 2.54,-1.27; 10 2.54,1.27; 11 5.08,-1.27; 12 5.08,1.27; 13 7.62,-1.27; 14 7.62,1.27
2XETHERNET = drill 0.9: B_1 -4.44,8.25; B_2 -3.17,10.79; B_3 -1.9,8.25; B_4 -0.63,10.79; B_5 0.64,8.25; B_6 1.91,10.79; B_7 3.18,8.25; B_8 4.45,10.79; T_1 4.45,17.02; T_2 3.18,14.48; T_3 1.91,17.02; T_4 0.64,14.48; T_5 -0.63,17.02; T_6 -1.9,14.48; T_7 -3.17,17.02; T_8 -4.44,14.48 | drill 1.1: B_9 -6.86,4.19; B_10 -4.32,4.19; B_11 4.32,4.19; B_12 6.86,4.19; T_9 -6.86,20.95; T_10 -4.32,20.95; T_11 4.32,20.95; T_12 6.86,20.95 | hole 3.2: -6.35,0; 6.35,0 | hole 1.6: -8.13,15.49; 8.13,15.49; -8.13,7.11; 8.13,7.11
10X1PCBBLOCK = drill 0.8: 1 -15.75,0; 2 -12.25,0; 3 -8.75,0; 4 -5.25,0; 5 -1.75,0; 6 1.75,0; 7 5.25,0; 8 8.75,0; 9 12.25,0; 10 15.75,0
DIP8 = drill 0.813 pad 1.6 octagon: 1 1.27,-3.81; 2 3.81,-3.81; 3 6.35,-3.81; 4 8.89,-3.81; 5 8.89,3.81; 6 6.35,3.81; 7 3.81,3.81; 8 1.27,3.81
70543-06 = drill 1.016 long: 1 -6.35,0; 2 -3.81,0; 3 -1.27,0; 4 1.27,0; 5 3.81,0; 6 6.35,0

### Placement (x,y rotation side)
4-NMOS  48.1,5.87 90 top
4-NMOS1  70.64,37.78 270 top
C1  85.09,93.34 0 bottom
C2  89.06,70.96 270 bottom
C3  51.44,36.99 135 top
C4  63.18,53.34 315 top
C5  61.75,51.91 315 top
C6  59.05,39.05 225 top
C7  57.63,40.48 225 top
C8  61.12,41.12 45 top
C9  59.69,42.55 45 top
C10  26.83,52.07 270 top
C11  88.27,5.71 90 top
C12  47.31,37.31 45 top
C13  64.61,54.77 315 top
C14  60.48,37.62 225 top
C15  81.6,5.71 90 top
C16  62.55,39.69 45 top
C17  87.63,10.48 180 top
C18  80.96,10.48 180 top
CAPCON  96.52,86.36 90 top
CAPCURR  92.71,33.02 90 top
ESTOP  7.62,72.39 270 top
FCCON  96.52,58.42 90 top
FCCURR  96.52,72.39 90 top
FCPRES  3.33,40.64 270 top
JP2  20.32,1.27 0 top
JTAG  26.83,46.99 0 top
L1  50.32,35.88 135 top
LD39300  86.04,84.61 180 bottom
LED1  28.57,3.65 180 top
LED2  32.38,3.65 180 top
LED3  36.2,3.65 180 top
LED4  40.01,3.65 180 top
LED5  97.95,9.37 270 top
LERROR  81.76,32.86 270 top
LRUN  81.76,27.78 270 top
LSTART  81.76,25.24 270 top
LSTOP  81.76,30.32 270 top
MCU  50.33,48.73 315 top
OUTPUT_0  29.53,93.98 0 top
OUTPUT_1  62.71,93.98 0 top
PWR  96.52,18.41 90 top
R1  95.25,10.79 180 top
R2  37.15,91.44 270 bottom
R4  72.87,91.44 270 bottom
R5  86.36,65.25 0 top
R6  86.36,62.23 180 top
R7  70.48,32.07 180 top
R9  12.7,22.86 0 top
R10  12.7,20.32 0 top
R11  12.7,17.78 0 top
R12  12.7,15.24 0 top
R13  12.7,12.7 0 top
R14  12.7,10.16 0 top
R15  80.01,90.17 180 top
R16  85.09,90.17 180 top
R17  86.36,58.42 180 top
R18  85.09,86.36 180 top
R19  86.36,46.67 180 top
R20  6.51,90.65 180 top
R21  12.7,58.42 270 top
R22  12.7,40.64 270 top
R23  24.29,52.07 90 top
R25  41.91,37.15 135 top
R26  39.53,39.53 135 top
R27  17.78,18.89 90 top
R28  17.94,11.43 90 top
R29  40.64,43.02 45 top
R30  42.23,13.34 90 top
R45  29.37,52.07 270 top
RESCON  92.71,44.45 90 top
START  7.62,83.82 270 top
SWITCH_RST  25.56,58.42 0 top
TANKPRES  3.33,58.42 270 top
THERMISTORS  3.49,17.78 90 top
U$1  67.94,2.86 0 top
U$2  77.79,64.77 270 top
U$3  70.48,64.77 90 top
U$4  80.8,44.77 270 top
X3  30.8,11.11 0 top

### Tracks (layer width: path | path; a pad name or v marks a point on that pad's centre or on a via)
3V
  Bottom 0.406: C2.1 89.09,72.39 FCCURR.2 93.98,74.17 93.98,76.36 88.11,82.23 LD39300.4
+12V
  Top 0.254: PWR.2 85.46,18.41
  Bottom 0.61: PWR.2 95.25,15.37 95.25,8.1 87.79,0.64 3.49,0.64 0.64,3.49 0.64,28.89 | 0.64,28.89 0.64,47.7 TANKPRES.1 | FCPRES.1 7.65,35.91 0.64,28.89
AMBTEMP1
  Top 0.254: R27.7 14.36,18.49 R11.2 13.65,17.46 12.7,16.51 6.03,16.51 THERMISTORS.7
AMBTEMP2
  Top 0.254: R27.8 17.07,17.78 16.35,17.78 13.81,15.24 R12.2 | 13.97,15.24 R12.2 | THERMISTORS.5 6.03,13.97 12.38,13.97 R12.2
AMBTEMP3
  Top 0.254: R28.5 17.24,12.7 R13.2 12.38,11.43 6.03,11.43 THERMISTORS.3
AMBTEMP4
  Top 0.254: R28.6 15.32,11.83 R14.2 12.38,8.89 6.03,8.89 THERMISTORS.1
ANA_DECOUP
  Top 0.254: MCU.27 52.7,38.58 52.7,37.15 52.07,36.51 C3.1 L1.1 51.12,35.24
CAN_RX  (via drill 0.3)
  Top 0.254: v43.66,46.35 42.73,45.43 MCU.7
  Bottom 0.254: v43.66,46.35 66.52,46.35 U$4.4
CAN_TX  (via drill 0.3)
  Top 0.254: MCU.8 43.11,45.02 43.81,45.72 44.45,45.72 v45.72,46.99
  Bottom 0.254: v45.72,46.99 73.5,46.99 U$4.1
CANH
  Bottom 0.254: U$1.B_1 63.18,11.43 63.18,13.97 64.61,15.4 71.6,15.4 72.39,16.2 U$1.T_1 73.66,21.14 73.66,25.88 79.38,31.59 82.07,31.59 86.04,35.56 86.04,39.69 84.77,40.96 U$4.7
CANL
  Top 0.254: U$1.B_2 66.84,15.72 69.5,15.72 U$1.T_2
  Bottom 0.254: U$1.T_2 71.12,25.56 83.98,38.42 U$4.6
CAPCON(S)
  Top 0.406: R18.1 CAPCON.2
CAPCURR  (via drill 0.3)
  Top 0.254: v39.21,34.92 39.21,36.15 R25.5
  Bottom 0.254: v39.21,34.92 42.55,31.59 76.36,31.59 81.44,36.67 81.44,40.48 83.19,42.23 85.41,42.23 86.68,40.96 86.68,37.94 92.71,31.91 CAPCURR.P$1
CAPVOLT  (via drill 0.3)
  Top 0.254: R15.1 v80.96,87.31 | R25.7 41.12,35.79 v41.12,35.72
  Top 0.406: R16.2 R15.1
  Bottom 0.254: v80.96,87.31 80.49,86.84 80.49,36.99 76.36,32.86 43.5,32.86 41.12,35.24 v41.12,35.72
ESTOP
  Top 0.254: ESTOP.P$1 19.51,73.89 MCU.96
ESTOP2
  Top 0.254: ESTOP.P$2 21.81,70.89 MCU.97
FCCON(S)
  Top 0.254: R17.1 FCCON.2
FCCURR  (via drill 0.3)
  Top 0.254: R25.6 40.16,35.97 v40.16,35.4
  Bottom 0.254: v40.16,35.4 40.16,34.92 42.86,32.23 76.36,32.23 80.96,36.83 80.96,68.74 87.63,75.41 92.18,75.41 FCCURR.1
FCPRES_S+
  Top 0.254: FCPRES.2 10.88,39.14 R22.2 11.75,39.37 33.66,39.37 35.4,37.62 39.32,37.62 R26.8
FCPRES_S-
  Top 0.254: FCPRES.3 10.88,42.14 R22.1 20.16,41.59 21.75,40.01 34.13,40.01 36.04,38.1 38.67,38.1 R26.7
FCTEMP1
  Top 0.254: R27.5 16.42,20.09 14.92,21.59 12.38,21.59 | R9.2 12.38,21.59 | 12.38,21.59 6.03,21.59 THERMISTORS.11
FCTEMP2
  Top 0.254: R10.2 14.68,19.29 | 14.68,19.29 R27.6 | THERMISTORS.9 6.03,19.05 14.44,19.05 14.68,19.29
FCVOLT  (via drill 0.3)
  Top 0.254: R25.8 42.32,35.31 v42.86,34.77 | v79.85,58.58 79.85,60.8 81.28,62.23 R6.2 R5.1
  Bottom 0.254: 43.5,34.13 v42.86,34.77 44.29,33.34 76.2,33.34 79.85,36.99 v79.85,58.58
FCVOLT+
  Top 0.254: R6.1 91.39,62.23 FCCON.1
FCVOLT+1
  Top 0.406: R16.1 91.39,90.17 CAPCON.1
GND  (via drill 0.3)
  Top 0.254: MCU.37 56.99,41.36 C7.2 | C9.2 | MCU.6 43.02,46.37 43.02,46.99 | R19.2 85.41,44.29 U$4.8 | 4-NMOS1.3 4-NMOS1.4 68.26,38.42 v68.9,37.78 | 4-NMOS1.8 72.55,34.61 71.12,36.04 v70.8,36.04 69.85,36.04 68.42,34.61 4-NMOS1.7 | 4-NMOS1.12 75.72,39.69 U$4.2 | C18.2 78.42,8.84 78.42,7.94 | C17.2 85.41,9.15 85.41,3.65
  Top 0.406: R18.2 84.14,86.84 v85.72,88.42
  Bottom 0.254: R2.1 37.81,92.84 42.23,88.42 OUTPUT_0.11 | R4.1 75.41,90.3 OUTPUT_1.11 | v49.05,3.17 52.23,3.17 v53.34,2.06 | FCCURR.3 89.23,69.39 C2.2 | CAPCURR.P$2 92.71,36.2 85.41,43.5 U$4.8 | v64.45,34.45 66.83,34.45 | 66.83,34.45 70.8,34.45 71.12,34.77 71.12,35.72 v70.8,36.04 | v68.9,37.78 68.9,36.51 66.83,34.45 | v78.9,40.96 U$4.2
  Bottom 0.406: v85.72,88.42 84.73,89.41 LD39300.1 83.76,93.27 C1.2
  pour Top (rank 5): 110,110 -10,110 -10,-10 110,-10
LED0
  Top 0.254: MCU.44 57.98,45.37 58.74,44.61 59.05,44.61 59.69,45.24 60.8,45.24 65.41,40.64 65.41,38.58 48.9,22.07 48.9,8.57 49.69,7.78 4-NMOS.6
LED0_O
  Top 0.254: LED1.A 28.57,10.16 X3.3 32.95,14.54 R30.5
LED1
  Top 0.254: MCU.47 58.99,46.42 59.69,45.72 60.96,45.72 65.88,40.8 65.88,38.42 53.82,26.35 53.82,3.97 52.55,2.7 4-NMOS.2
LED1_O
  Top 0.254: LED2.A 32.07,5.72 X3.4 34.69,13.73 R30.6
LED2  (via drill 0.3)
  Top 0.254: v42.07,15.88 42.07,16.51 64.45,38.89 64.45,40.32 60.48,44.29 60.01,44.29 59.37,43.66 58.26,43.66 57.25,44.66 MCU.42 | 4-NMOS.13 v43.18,2.7
  Bottom 0.254: v42.07,15.88 42.07,3.81 v43.18,2.7
LED2_O
  Top 0.254: LED3.A 34.61,6.99 X3.5 36.43,12.94 R30.7
LED3  (via drill 0.3)
  Top 0.254: MCU.43 58.46,44.13 59.21,44.13 59.85,44.77 60.64,44.77 64.93,40.48 64.93,38.73 43.02,16.83 v43.02,15.4 | 4-NMOS.9 v43.34,7.78
  Bottom 0.254: v43.02,15.4 43.02,8.1 v43.34,7.78
LED3_O
  Top 0.254: LED4.A 37.15,8.26 X3.6 38.17,12.13 R30.8
LED_ERROR
  Top 0.254: 4-NMOS1.9 72.23,35.88 71.44,36.67 71.44,40.64 68.42,43.66 67.79,43.66 60.96,50.48 60.57,50.48 MCU.51
LED_RUN
  Top 0.254: MCU.48 59.94,46.2 61.12,46.2 66.36,40.96 4-NMOS1.2
LED_START
  Top 0.254: 4-NMOS1.6 68.58,35.88 69.53,36.83 69.53,41.91 68.42,43.02 64.93,43.02 61.28,46.67 60.87,46.67 MCU.50
LED_STOP
  Top 0.254: MCU.52 60.34,50.96 61.12,50.96 67.94,44.13 68.74,44.13 71.91,40.96 4-NMOS1.13
MCU_RST  (via drill 0.3)
  Top 0.254: C10.2 JTAG.6 | C10.2 R23.1 24.08,51.17 v23.18,52.07 | C10.2 27.09,51.17 28.1,50.16 38.1,50.16 39.21,51.28 40.71,51.28 MCU.98
  Bottom 0.254: SWITCH_RST.3 22.31,52.94 v23.18,52.07
MFLOW  (via drill 0.3)
  Top 0.254: R26.5 38.19,39.94 v37.62,39.37
  Bottom 0.254: THERMISTORS.13 23.65,25.4 v37.62,39.37
N$1
  Top 0.254: R29.2 43.14,43.66 MCU.10
N$2
  Top 0.254: 4-NMOS.5 49.37,6.51 48.26,7.62 48.26,10.48 44.2,14.54 R30.4
N$3
  Top 0.254: MCU.12 41.53,40.64 41.12,40.64 40.25,39.78 R26.2
N$4
  Top 0.254: 4-NMOS.1 48.74,1.43 47.62,2.54 47.62,10.32 44.21,13.73 R30.3
N$5
  Top 0.254: MCU.13 40.82,39.22 R26.1
N$6
  Top 0.254: C7.1 58.26,41.5 MCU.39 59.88,39.88 | 59.88,39.88 61.28,38.49 C14.1 | C6.1 59.88,39.88 | 59.88,39.88
N$7
  Top 0.254: 4-NMOS.14 45.88,1.43 46.99,2.54 46.99,10.16 44.22,12.94 R30.2
N$8
  Top 0.254: 4-NMOS.10 45.72,6.51 46.35,7.14 46.35,10 44.13,12.22 42.94,12.22 R30.1
N$9
  Top 0.254: MCU.40 56.53,43.96 58.74,41.75 | C9.1 58.9,41.75 58.74,41.75 | 58.74,41.75 60.4,40.08 | 60.4,40.08 61.44,39.05 C16.1 | C8.1 60.4,40.4 60.4,40.08
N$10
  Top 0.254: MCU.23 46.67,38 C12.1
N$11
  Top 0.254: MCU.24 47.94,38.57 C12.2
N$12
  Top 0.254: U$2.1 77.79,80.49 72.87,80.49 71.6,79.22 68.9,79.22 53.66,63.98 53.66,59.05 53.98,58.74 52.7,57.47 MCU.72
N$13
  Top 0.254: R26.3 39.78,40.25 40.64,41.12 41.3,41.12 MCU.11
N$14
  Top 0.254: U$2.2 77.79,76.99 72.87,76.99 71.6,75.72 66.67,75.72 54.61,63.66 54.61,59.37 54.93,59.05 54.93,58.42 53.98,57.47 53.98,57.31 MCU.70
N$15
  Top 0.254: R26.4 38.89,40.59 38.89,40.16 44.13,34.92 46.35,34.92 49.09,37.66 MCU.25
N$16
  Top 0.254: U$2.3 77.79,73.5 72.87,73.5 71.6,72.23 64.45,72.23 55.56,63.34 55.56,59.69 55.88,59.37 55.88,58.1 55.09,57.31 55.09,57.02 MCU.68 54.13,56.04
N$17
  Top 0.254: MCU.28 53.18,38.81 53.18,36.2 37.08,20.09 R27.4
N$18
  Top 0.254: R27.2 18.41,18.41 36.67,18.41 54.13,35.88 54.13,39.37 53.02,40.48 MCU.30
N$19
  Top 0.254: 18.57,12.7 R28.4 18.63,12.7 19.21,12.7 23.65,17.14 36.67,17.14 55.09,35.56 55.09,39.69 53.66,41.12 MCU.32
N$20
  Top 0.254: 18.57,11.91 R28.3 18.97,11.83 23.81,16.67 36.83,16.67 55.56,35.4 55.56,39.85 54.13,41.27 54.13,41.43 MCU.33
N$21
  Top 0.254: MCU.14 42.23,39.92 42.23,39.21 41.5,38.49 R25.4
N$22
  Top 0.254: U$2.4 72.87,70.01 71.6,68.74 62.23,68.74 56.52,63.02 56.52,60.01 56.83,59.69 56.83,57.78 56.2,57.15 56.2,56.72 MCU.66
N$23
  Top 0.254: U$2.5 72.87,66.52 71.6,65.25 60.01,65.25 57.47,62.71 57.47,60.33 57.78,60.01 57.78,57.47 57.15,56.83 57.15,56.26 MCU.64 55.56,54.61
N$24
  Top 0.254: U$2.6 77.79,62.87 72.71,62.87 71.6,61.75 63.34,61.75 58.1,56.52 58.1,55.8 MCU.62
N$25
  Top 0.254: R27.1 18.41,17.62 36.51,17.62 54.61,35.72 54.61,39.53 53.34,40.8 MCU.31
N$26
  Top 0.254: R27.3 18.41,19.37 36.99,19.37 53.66,36.04 53.66,39.05 52.7,40.01 MCU.29
N$27
  Top 0.254: MCU.15 42.7,39.69 42.7,38.51 R25.3
N$28
  Top 0.254: MCU.16 43.18,39.46 43.18,37.85 R25.2
N$29
  Top 0.254: MCU.17 43.66,39.23 43.66,37.2 R25.1
N$30
  Top 0.254: 56.99,53.18 MCU.60 59.05,55.33 59.05,56.2 63.66,60.8 67.63,60.8 70.17,58.26 71.6,58.26 72.71,59.37 77.79,59.37 U$2.7
N$31
  Top 0.254: 57.63,52.55 MCU.58 60.01,54.87 60.01,55.88 63.98,59.85 67.15,59.85 69.06,57.94 69.06,55.56 69.85,54.77 71.6,54.77 72.71,55.88 77.79,55.88 U$2.8
N$32
  Top 0.254: 4-NMOS1.5 66.04,37.15 65.56,36.67 65.56,34.13 67,32.69 R7.4
N$33  (via drill 0.3)
  Top 0.254: 4-NMOS1.1 68.1,42.23 v68.9,41.43 | v70.01,35.08 70.08,35.01 R7.3
  Bottom 0.254: v68.9,41.43 70.01,40.32 v70.01,35.08
N$34
  Top 0.254: R1.1 LED5.A
N$36
  Top 0.254: 57.31,52.86 MCU.59 59.53,55.1 59.53,56.04 63.82,60.33 67.47,60.33 70.48,57.31 U$3.3 70.48,56.04
N$37
  Top 0.254: 56.67,53.66 MCU.61 58.58,55.56 58.58,56.36 63.5,61.28 68.74,61.28 U$3.4
N$38
  Top 0.254: U$3.5 68.74,64.77 60.17,64.77 57.94,62.55 57.94,60.48 58.26,60.17 58.26,57.31 57.63,56.67 57.63,56.03 MCU.63 55.88,54.29
N$39
  Top 0.254: U$3.6 70.48,66.67 68.9,68.26 62.39,68.26 56.99,62.87 56.99,60.17 57.31,59.85 57.31,57.63 56.67,56.99 56.67,56.49 MCU.65
N$40
  Top 0.254: U$3.7 70.48,70.17 68.9,71.75 64.61,71.75 56.04,63.18 56.04,59.85 56.36,59.53 56.36,57.94 55.72,57.31 55.72,56.95 MCU.67 54.45,55.72
N$41
  Top 0.254: U$3.8 70.48,73.66 68.9,75.25 66.83,75.25 55.09,63.5 55.09,59.53 55.4,59.21 55.4,58.26 54.45,57.31 54.45,57.09 MCU.69
N$42
  Top 0.254: U$3.9 70.48,77.15 67.47,77.15 54.13,63.82 54.13,59.21 54.45,58.9 54.45,58.58 53.02,57.15 MCU.71
N$43
  Top 0.254: U$3.10 70.48,80.64 69.69,80.64 53.18,64.14 53.18,58.9 53.34,58.74 52.39,57.78 MCU.73
N$44
  Top 0.254: 4-NMOS1.14 77.63,42.23 78.11,41.75 78.11,35.4 74.77,32.07 71.28,32.07 70.89,32.46 R7.2
N$45
  Top 0.254: 4-NMOS1.10 74.77,37.15 75.41,36.51 75.41,33.97 74.13,32.69 R7.1
N$46
  Top 0.254: LSTART.A 76.2,25.24 75.49,25.24 74.93,25.24 69.22,30.96 69.22,31.37 R7.5
N$47
  Top 0.254: R7.8 71.83,31.59 75.56,31.59 76.83,32.86 LERROR.A
N$48
  Top 0.254: LSTOP.A 71.6,30.32 70.96,30.96 70.96,31.37 R7.7
N$49
  Top 0.254: LRUN.A 73.18,27.78 70.01,30.96 70.01,31.37 R7.6
N$91  (via drill 0.3)
  Top 0.254: R45.1 29.74,52.97 v30.64,52.07
  Bottom 0.254: JTAG.8 30.64,49.53 v30.64,52.07
OP0-12_1
  Top 0.254: OUTPUT_0.1 16.83,77.28 MCU.95
OP0-12_2
  Top 0.254: OUTPUT_0.2 19.37,75.45 MCU.94
OP0-12_3
  Top 0.254: OUTPUT_0.3 21.91,73.62 MCU.93
OP0-12_4
  Top 0.254: OUTPUT_0.4 24.45,71.78 MCU.92
OP0-24_12
  Top 0.254: OUTPUT_0.5 26.99,69.95 MCU.91
OP0-FAN_IN
  Top 0.254: OUTPUT_0.6 29.53,68.12 MCU.90
OP0-FAN_TAC
  Top 0.254: OUTPUT_0.8 34.61,64.45 MCU.88
OP0-H2_OK1
  Top 0.254: OUTPUT_0.10 39.69,60.79 MCU.86
OP0-H2_OK2
  Top 0.254: MCU.87 37.15,62.62 OUTPUT_0.9
  Bottom 0.254: R2.2 OUTPUT_0.9
OP0-SRV_IN
  Top 0.254: OUTPUT_0.7 32.07,66.28 MCU.89
OP1-12_1
  Top 0.254: OUTPUT_1.1 50.01,68.74 44.93,63.66 44.93,56.26 MCU.85
OP1-12_2
  Top 0.254: OUTPUT_1.2 52.55,70.48 45.4,63.34 45.4,56.49 MCU.84
OP1-12_3
  Top 0.254: OUTPUT_1.3 55.09,72.23 45.88,63.02 45.88,58.13 MCU.81
OP1-12_4
  Top 0.254: OUTPUT_1.4 57.63,73.98 46.35,62.71 46.35,58.36 MCU.80
OP1-24_12
  Top 0.254: OUTPUT_1.5 60.17,75.72 46.83,62.39 46.83,58.59 MCU.79
OP1-FAN_IN
  Top 0.254: OUTPUT_1.6 62.71,77.47 47.31,62.07 47.31,58.82 MCU.78
OP1-FAN_TAC
  Top 0.254: OUTPUT_1.8 67.79,80.96 48.26,61.44 48.26,59.28 MCU.76
OP1-H2_OK1
  Top 0.254: OUTPUT_1.10 72.87,84.45 52.7,64.29 52.7,58.88 MCU.74
  Bottom 0.254: R4.2 OUTPUT_1.10
OP1-H2_OK2
  Top 0.254: OUTPUT_1.9 70.33,82.71 52.23,64.61 52.23,59.11 MCU.75
OP1-SRV_IN
  Top 0.254: OUTPUT_1.7 65.25,79.22 47.78,61.75 47.78,59.05 MCU.77
RESCON(S)
  Top 0.254: R19.1 91.03,42.95 RESCON.P$1
START(S)
  Top 0.254: R20.1 7.46,85.48 START.P$1
TANKPRES_S+
  Top 0.254: TANKPRES.2 10.88,56.92 R21.2 15.24,57.47 19.21,53.5 19.21,43.5 22.07,40.64 34.45,40.64 36.35,38.73 38.17,38.73 R26.6 38.65,39.21
TANKPRES_S-
  Top 0.254: TANKPRES.3 10.88,59.92 R21.1 14.29,59.37 19.84,53.82 19.84,43.81 22.38,41.27 38.42,41.27 39.53,42.38 R29.1
TCK  (via drill 0.3)
  Top 0.254: v38.73,46.99 40.1,46.99 MCU.1
  Bottom 0.254: JTAG.1 23.02,46.99 v38.73,46.99
TDI
  Top 0.254: JTAG.9 39.54,45.72 MCU.2
TDO
  Top 0.254: JTAG.3 24.92,45.72 26.19,46.99 27.46,46.99 27.94,46.51 27.94,45.09 29.05,43.97 38.5,43.97 MCU.3
TMS
  Top 0.254: JTAG.5 26.83,45.24 28.89,43.18 38.42,43.18 MCU.4
USB_D+  (via drill 0.3)
  Top 0.254: JP2.D+ v20.32,5.24 | MCU.36 56.36,41.29 v56.36,40.96
  Bottom 0.254: v20.32,5.24 20.32,17.94 38.73,36.35 51.59,36.35 v56.36,40.96
USB_D-  (via drill 0.3)
  Top 0.254: MCU.35 55.4,41.53 v55.4,41.12 | JP2.D- 19.67,6.18 v19.68,6.19
  Bottom 0.254: v55.4,41.12 51.12,36.83 38.58,36.83 19.68,17.94 v19.68,6.19
USB_VBUS  (via drill 0.3)
  Top 0.254: JP2.VBUS 19.05,3.95 v19.05,5.24 | MCU.34 53.37,42.86 v53.18,42.86
  Bottom 0.254: v19.05,5.24 19.05,18.1 38.26,37.31 49.85,37.31 50.48,37.94 50.48,41.27 52.07,42.86 v53.18,42.86
VCC  (via drill 0.3)
  Top 0.254: R10.1 v10.16,20.32 | R11.1 v10.16,17.78 | R12.1 v10.16,15.24 | R13.1 v10.16,12.7 | R14.1 11.59,10 v10.16,10 | R9.1 v10.16,22.86 | MCU.5 38.26,42.32 v38.26,42.23 | R45.2 29,51.17 28.1,52.07 25.19,52.07 R23.2 24.24,53.02 23.02,53.02 22.38,52.39 22.38,51.28 24.29,49.37 JTAG.4 | MCU.53 62.65,53.98 | 63.98,55.3 C13.1 64.08,55.41 | 62.65,53.98 C4.1 C5.1 | 62.65,53.98 64.08,55.41 | L1.2 v49.69,38.42 | MCU.38 | MCU.38 v54.77,44.29 | MCU.82 46.2,57.1 v46,57.1 | 64.08,55.41 64.23,55.56 64.23,55.66 v64.77,56.2 | 4-NMOS1.11 U$4.3
  Top 0.406: X3.1 24.45,3.65 27.62,0.48 40.64,0.48 41.43,1.27 41.43,3.17 43.5,5.24 4-NMOS.11
  Bottom 0.254: JTAG.7 29.37,44.77 31.91,42.23 v38.26,42.23
  other vias: 80.64,6.99 80.64,8.26 82.87,6.99 82.87,8.26 82.87,9.53 82.87,10.79 81.92,11.75 88.58,11.75 89.53,10.79 89.53,9.53 89.53,8.26 89.53,6.99 87.31,6.99 87.31,8.26 80.64,18.41 84.45,18.41
  pour Bottom (rank 5): 105,105 -5,105 -5,-5 105,-5
  pour Top: 79.06,12.06 79.06,5.71 93.34,5.71 95.57,7.94 95.57,20.32 79.06,20.32

### Text on the board
tPlace: CAPVOLT | 8 | 8 | 7 | 7 | University of Alberta EcoCar Team / E-P-206-R1.0 Fuel Cell Control Board | 6 | 6 | 5 | 5 | 4 | 4 | 3 | 3 | 2 | FCVOLT | 2 | 1 | 1 | 5V | 5V | GND | GND | ERR | STOP | RUN | MFLOW | START | FT1 | FT2 | AT1 | AT2 | AT3 | AT4